# Altium schematic sheet main.SchDoc
size A3
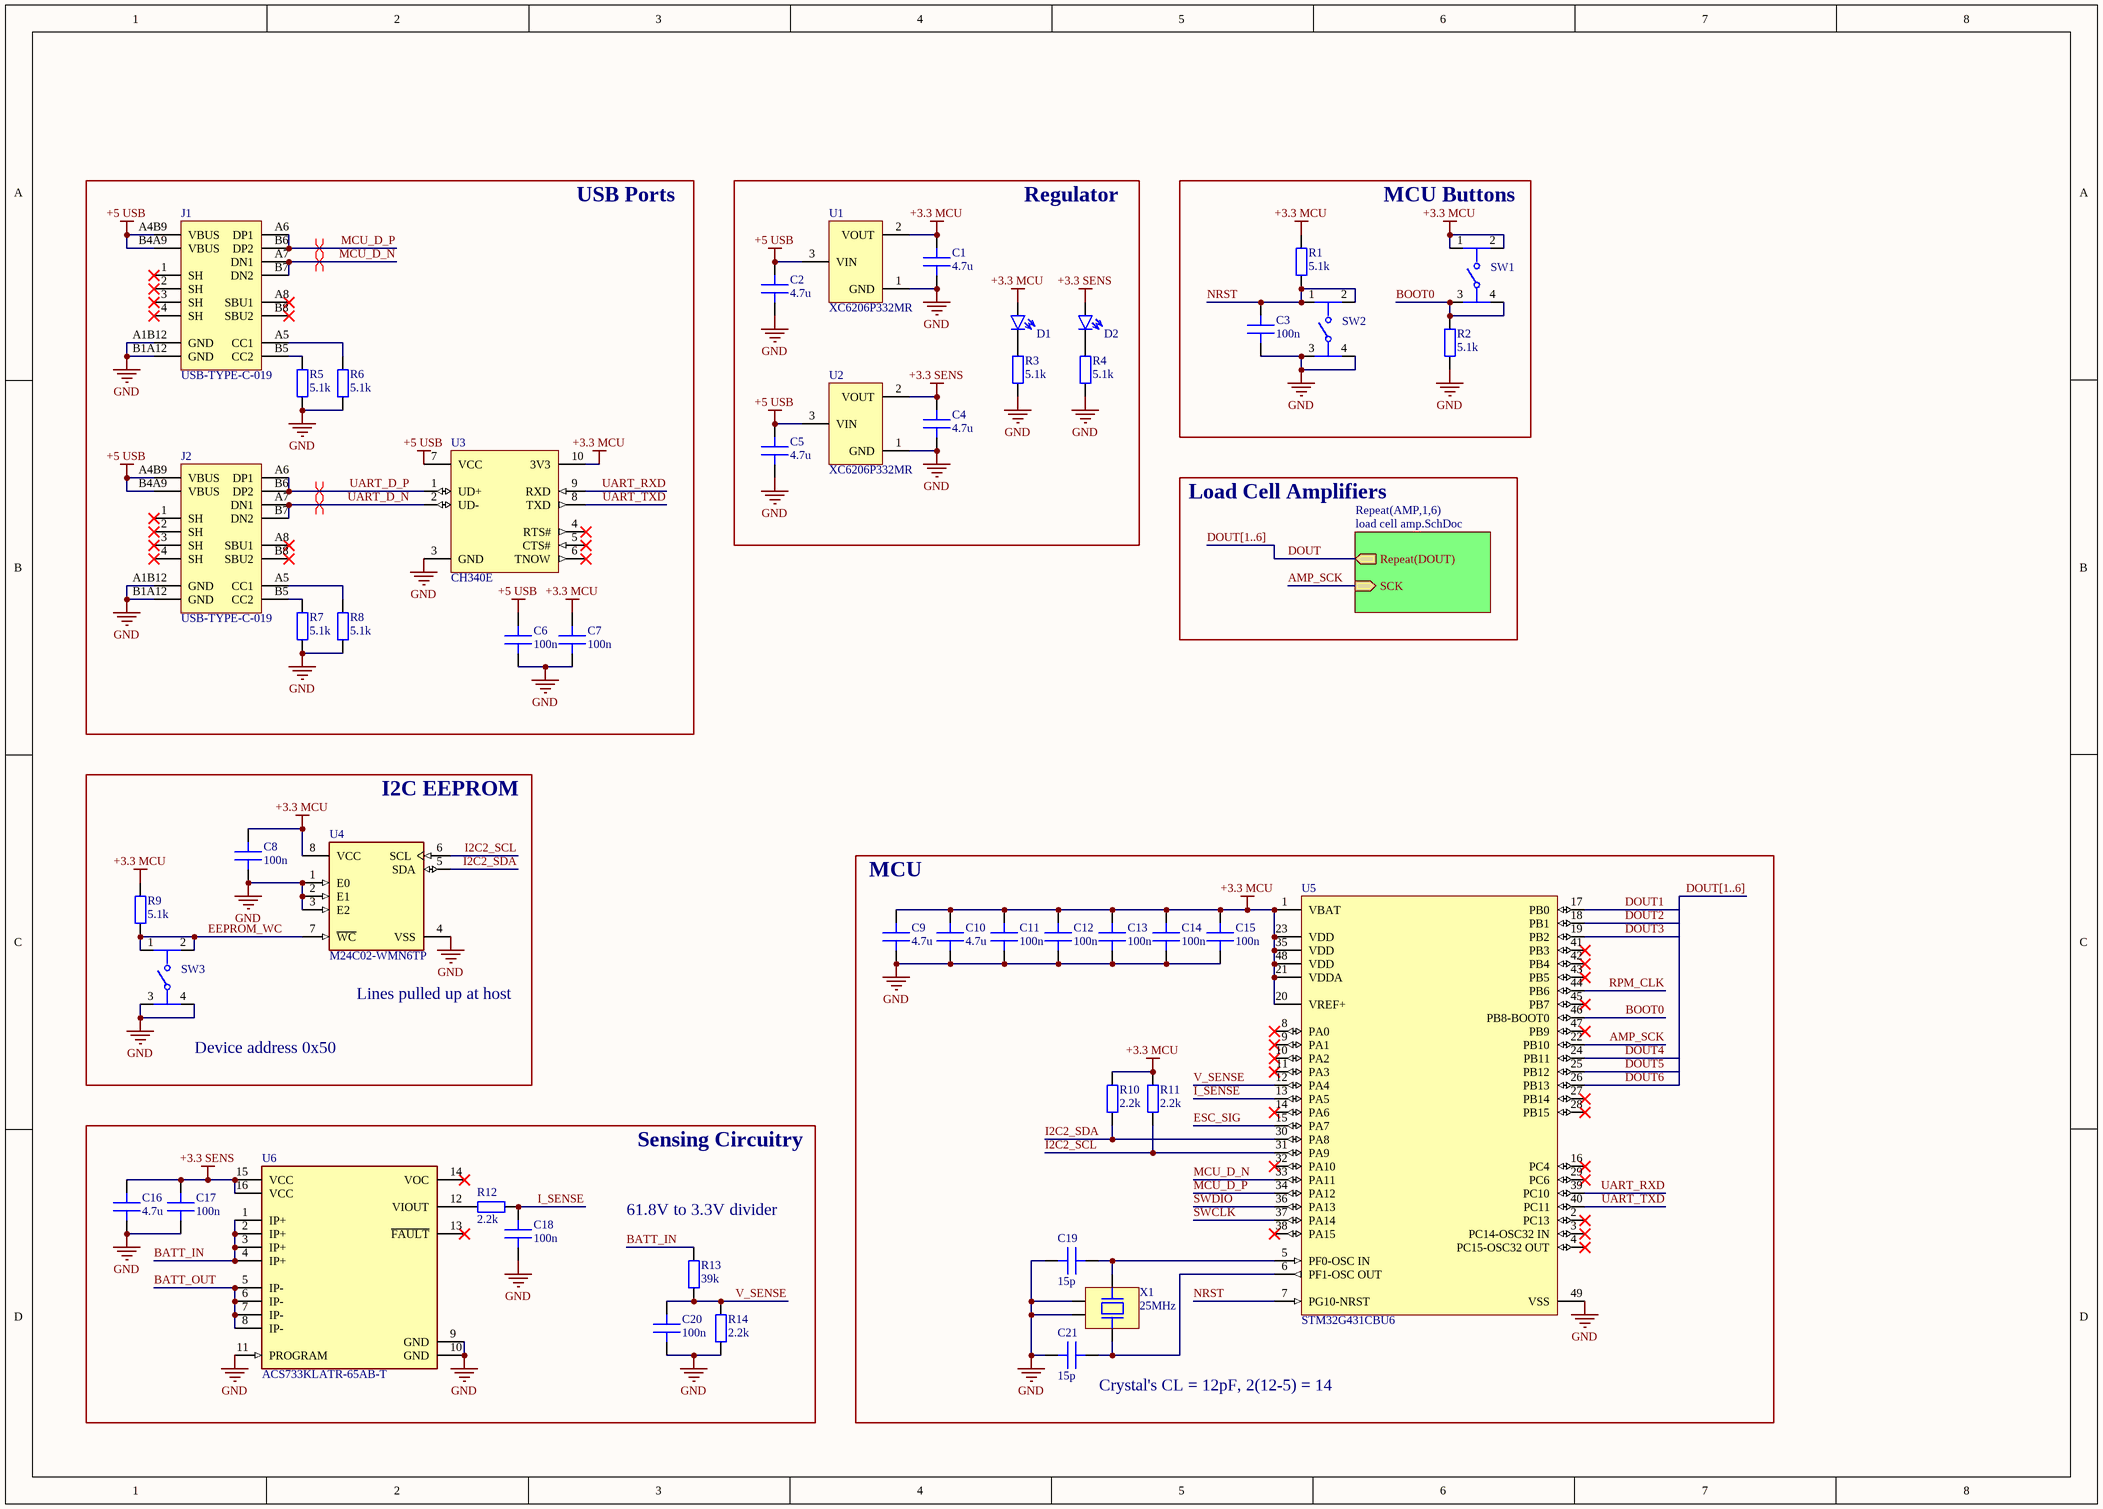
[diagram p0: main.SchDoc]

## Parts
C1  4.7u  [IPC C C0603 NO SILK]
C2  4.7u  [IPC C C0603 NO SILK]
C3  100n  [IPC C C0402 NO SILK]
C4  4.7u  [IPC C C0603 NO SILK]
C5  4.7u  [IPC C C0603 NO SILK]
C6  100n  [IPC C C0402 NO SILK]
C7  100n  [IPC C C0402 NO SILK]
C8  100n  [IPC C C0402 NO SILK]
C9  4.7u  [IPC C C0603 NO SILK]
C10  4.7u  [IPC C C0603 NO SILK]
C11  100n  [IPC C C0402 NO SILK]
C12  100n  [IPC C C0402 NO SILK]
C13  100n  [IPC C C0402 NO SILK]
C14  100n  [IPC C C0402 NO SILK]
C15  100n  [IPC C C0402 NO SILK]
C16  4.7u  [IPC C C0603 NO SILK]
C17  100n  [IPC C C0402 NO SILK]
C18  100n  [IPC C C0402 NO SILK]
C19  15p  [IPC C C0402 NO SILK]
C20  100n  [IPC C C0402 NO SILK]
C21  15p  [IPC C C0402 NO SILK]
D1  Generic LED 0603  [IPC C D0603]  (value not drawn)
D2  Generic LED 0603  [IPC C D0603]  (value not drawn)
J1  USB-TYPE-C-019  [USB-TYPE-C-12+4P]
J2  USB-TYPE-C-019  [USB-TYPE-C-12+4P]
R1  5.1k  [IPC C R0402 NO SILK]
R2  5.1k  [IPC C R0402 NO SILK]
R3  5.1k  [IPC C R0402 NO SILK]
R4  5.1k  [IPC C R0402 NO SILK]
R5  5.1k  [IPC C R0402 NO SILK]
R6  5.1k  [IPC C R0402 NO SILK]
R7  5.1k  [IPC C R0402 NO SILK]
R8  5.1k  [IPC C R0402 NO SILK]
R9  5.1k  [IPC C R0402 NO SILK]
R10  2.2k  [IPC C R0402 NO SILK]
R11  2.2k  [IPC C R0402 NO SILK]
R12  2.2k  [IPC C R0402 NO SILK]
R13  39k  [IPC C R0402 NO SILK]
R14  2.2k  [IPC C R0402 NO SILK]
SW1  PTS810SJM250SMTRLFS  [FP-PTS810SJM250SMTRLFS-MFG]  (value not drawn)
SW2  PTS810SJM250SMTRLFS  [FP-PTS810SJM250SMTRLFS-MFG]  (value not drawn)
SW3  PTS810SJM250SMTRLFS  [FP-PTS810SJM250SMTRLFS-MFG]  (value not drawn)
U1  XC6206P332MR  [SOT23-3]
U2  XC6206P332MR  [SOT23-3]
U3  CH340E  [MSOP-UN10_L]
U4  M24C02-WMN6TP  [FP-SO8N-SO-A-MFG]
U5  STM32G431CBU6  [QFN50P700X700X60_HS-49L]
U6  ACS733KLATR-65AB-T  [FP-LA-16-MFG]
X1  25MHz  [OSC-SMD_4P-L3.2-W2.5-BL]

## Blocks framed on the sheet
USB Ports: C6 C7 J1 J2 R5-R8 U3
Regulator: C1 C2 C4 C5 D1 D2 R3 R4 U1 U2
MCU Buttons: C3 R1 R2 SW1 SW2
I2C EEPROM: C8 R9 SW3 U4
MCU: C9-C15 C19 C21 R10 R11 U5 X1
Sensing Circuitry: C16-C18 C20 R12-R14 U6

## Sub-sheets
Repeat(AMP,1,6) = load cell amp.SchDoc: Repeat(DOUT) (out), SCK (in)

## Nets
+3.3 MCU: C1.2 C7.2 C8.2 C9.2 C10.2 C11.2 C12.2 C13.2 C14.2 C15.2 D1.1(A) R1.2 R9.2 R10.2 R11.2 SW1.1 SW1.2 U1.2(VOUT) U3.10(3V3) U4.8(VCC) U5.1(VBAT) U5.20(VREF+) U5.21(VDDA) U5.23(VDD) U5.35(VDD) U5.48(VDD)
+3.3 SENS: C4.2 C16.2 C17.2 D2.1(A) U2.2(VOUT) U6.15(VCC) U6.16(VCC)
+5 USB: C2.2 C5.2 C6.2 J1.A4B9(VBUS) J1.B4A9(VBUS) J2.A4B9(VBUS) J2.B4A9(VBUS) U1.3(VIN) U2.3(VIN) U3.7(VCC)
GND: C1.1 C2.1 C3.1 C4.1 C5.1 C6.1 C7.1 C8.1 C9.1 C10.1 C11.1 C12.1 C13.1 C14.1 C15.1 C16.1 C17.1 C18.1 C19.2 C20.1 C21.2 J1.A1B12(GND) J1.B1A12(GND) J2.A1B12(GND) J2.B1A12(GND) R2.1 R3.1 R4.1 R5.1 R6.1 R7.1 R8.1 R14.1 SW2.3 SW2.4 SW3.3 SW3.4 U1.1(GND) U2.1(GND) U3.3(GND) U4.1(E0) U4.2(E1) U4.3(E2) U4.4(VSS) U5.49(VSS) U6.9(GND) U6.10(GND) U6.11(PROGRAM) X1.2 X1.4
AMP_SCK: U5.22(PB10) ; sheet Repeat(AMP,1,6)/SCK
BATT_IN: R13.2 U6.1(IP+) U6.2(IP+) U6.3(IP+) U6.4(IP+)
BATT_OUT: U6.5(IP-) U6.6(IP-) U6.7(IP-) U6.8(IP-)
BOOT0: R2.2 SW1.3 SW1.4 U5.46(PB8-BOOT0)
DOUT: sheet Repeat(AMP,1,6)/Repeat(DOUT)
DOUT1: U5.17(PB0)
DOUT2: U5.18(PB1)
DOUT3: U5.19(PB2)
DOUT4: U5.24(PB11)
DOUT5: U5.25(PB12)
DOUT6: U5.26(PB13)
EEPROM_WC: R9.1 SW3.1 SW3.2 U4.7(~{WC})
ESC_SIG: U5.15(PA7)
I2C2_SCL: R11.1 U4.6(SCL) U5.31(PA9)
I2C2_SDA: R10.1 U4.5(SDA) U5.30(PA8)
I_SENSE: C18.2 R12.1 U5.13(PA5)
MCU_D_N: J1.A7(DN1) J1.B7(DN2) U5.33(PA11)
MCU_D_P: J1.A6(DP1) J1.B6(DP2) U5.34(PA12)
NRST: C3.2 R1.1 SW2.1 SW2.2 U5.7(PG10-NRST)
RPM_CLK: U5.44(PB6)
SWCLK: U5.37(PA14)
SWDIO: U5.36(PA13)
UART_D_N: J2.A7(DN1) J2.B7(DN2) U3.2(UD-)
UART_D_P: J2.A6(DP1) J2.B6(DP2) U3.1(UD+)
UART_RXD: U3.9(RXD) U5.39(PC10)
UART_TXD: U3.8(TXD) U5.40(PC11)
V_SENSE: C20.2 R13.1 R14.2 U5.12(PA4)
NetC19_1: C19.1 U5.5(PF0-OSC_IN) X1.1
NetC21_1: C21.1 U5.6(PF1-OSC_OUT) X1.3
NetD1_2: D1.2(C) R3.2
NetD2_2: D2.2(C) R4.2
NetJ1_A5: J1.A5(CC1) R6.2
NetJ1_B5: J1.B5(CC2) R5.2
NetJ2_A5: J2.A5(CC1) R8.2
NetJ2_B5: J2.B5(CC2) R7.2
NetR12_2: R12.2 U6.12(VIOUT)

Not connected (* = marked no-connect by the designer): J1 1(SH)* 2(SH)* 3(SH)* 4(SH)* A8(SBU1)* B8(SBU2)*; J2 1(SH)* 2(SH)* 3(SH)* 4(SH)* A8(SBU1)* B8(SBU2)*; U3 4(RTS#)* 5(CTS#)* 6(TNOW)*; U5 2(PC13)* 3(PC14-OSC32_IN)* 4(PC15-OSC32_OUT)* 8(PA0)* 9(PA1)* 10(PA2)* 11(PA3)* 14(PA6)* 16(PC4)* 27(PB14)* 28(PB15)* 29(PC6)* 32(PA10)* 38(PA15)* 41(PB3)* 42(PB4)* 43(PB5)* 45(PB7)* 47(PB9)*; U6 13(~{FAULT})* 14(VOC)*

## Buses and harness runs
bus DOUT[1..6]

## Layout directives
differential pair: MCU_D_N, MCU_D_P, UART_D_N, UART_D_P

## Notes on the sheet
- Load Cell Amplifiers
- (near SW3) Device address 0x50
- (near U4) Lines pulled up at host
- (near R13) 61.8V to 3.3V divider
- (near C21) Crystal's CL = 12pF, 2(12-5) = 14

## Library data of the parts
C1 C2 C4 C5 C9 C10 C16 = Generic CAP 0603: Value: 4.7u
C3 C6-C8 C11-C15 C17-C21 = Generic CAP 0402
  C3 C6-C8 C11-C15 C17 C18 C20: Value: 100n
  C19 C21: Value: 15p
J1 J2 = USB-TYPE-C-019: Connector Type:Type-C Standard:- Gender:Female Number of Contacts:16 Number of Ports:1 Mounting Style:Surface Mount Current Rating - Power (Max):3A Operating Temperature Range:-25℃~+85℃ Operating Temperature Range:-25℃~+85℃; Manufacturer: DEALON(德艺隆); Add into BOM: yes; Connector Type: Type-C; Gender: Female; Number of Contacts: 16; Number of Ports: 1; Current Rating - Power (Max): 3A; Symbol: USB-TYPE-C-019; Device: USB-TYPE-C-019; LCSC Part Name: Type-C 母座 卧贴; Supplier Part: C2927039; Manufacturer Part: USB-TYPE-C-019; Supplier Footprint: SMD; JLCPCB Part Class: Extended Part; Datasheet: https://atta.szlcsc.com/upload/public/pdf/source/20211217/CCD3D517E355E8E0CC52ABD8D5784AD8.pdf; Supplier: LCSC; Convert to PCB: yes; Standard: -; Mounting Style: Surface Mount; Operating Temperature Range: -25℃~+85℃
R1-R14 = Generic RES 0402
  R1-R9: Value: 5.1k
  R10-R12 R14: Value: 2.2k
  R13: Value: 39k
SW1-SW3 = CMP-10040-000001-2: SWITCH TACTILE SPST-NO 0.05A 16V; Throw Configuration: SPST; Operating Force: 160gf; Actuator Type: Standard; Switch Travel: 0.15mm; Switch Function: Off-Mom; Max Current Rating: 50mA; Mechanical Life: 150000Cycles; Illumination Type: Non-Illuminated; Package Quantity: 2900; Depth: 4.6mm; Mount: Surface Mount; Packaging: Tape and Reel; Length: 3.2mm; RoHS Compliant: Yes; Case/Package: SMD/SMT; Voltage Rating (DC): 16V; Min Operating Temperature: -40°C; Termination: J-Bend; Lead Free: Lead Free; Contact Plating: Silver; Orientation: Straight; Max Operating Temperature: 85°C; Current Rating: 50mA; Color: Black
U1 U2 = 3.3V Regulator XC6206P332MR_C5446: Output Type: Output Polarity:Positive Number of Outputs:1 Maximum Input Voltage:6V Output Voltage:3.3V~3.3V Output Voltage:3.3V~3.3V Dropout Voltage:680mV@(100mA) Output Current:200mA Power Supply Rejection Ratio (PSRR):-; Manufacturer: TOREX(特瑞仕); Add into BOM: yes; Number of Outputs: 1; Maximum Input Voltage: 6V; Output Current: 200mA; Symbol: XC6206P332MR; Device: XC6206P332MR_C5446; LCSC Part Name: 正 Vin=6V Vout=3.3V 200mA; Supplier Part: C5446; Manufacturer Part: XC6206P332MR; Supplier Footprint: SOT-23-3L; JLCPCB Part Class: Basic Part; Datasheet: https://atta.szlcsc.com/upload/public/pdf/source/20130801/1457706628791.pdf; Supplier: LCSC; Convert to PCB: yes; Output Polarity: Positive; Output Voltage: 3.3V~3.3V; Dropout Voltage: 680mV@(100mA); Power Supply Rejection Ratio (PSRR): -
U4 = CMP-2000-05370-2: IC EEPROM 2K I2C 400KHZ 8SO; Manufacturer: STMicroelectronics; Min Supply Voltage: 2.5V; Standoff Height: 0.1mm; Nominal Supply Current: 0.5-1mA; Access Time: 900ns; Memory Size: 2Kbits; Max Supply Voltage: 5.5V; Digikey Description: IC EEPROM 2K I2C 400KHZ 8SO; Memory Type: EEPROM; ComponentLink2URL: https://www.st.com/resource/en/datasheet/m24c02-w.pdf; Device Class L3: EEPROM; Interface: I2C; Temperature Range High: +85°C; Mouser Description: M24C02 Series 2 Kb (256 x 8) 2.5 V SMT Serial I²C Bus EEPROM - SOIC-8; RoHS: TRUE; Lead Free: Yes; Ambient Temperature Range Low: -40°C; Temperature: -40°C to +85°C; Device Class L1: Integrated Circuits (ICs); Temperature Range Low: -40°C; Frequency: 400kHz; Category: IC; Manufacturer Part Number: M24C02-WMN6TP; Height: 1.75mm; Octopart: https://octopart.com/m24c02-wmn6tp-stmicroelectronics-55404516; Automotive: No; Ambient Temperature Range High: +85°C; ComponentLink2Description: Datasheet; Package: SO8N-SO-A; Device Class L2: Memory
U6 = CMP-82923-000073-1: AUTOMOTIVE GRADE HIGH BANDWIDTH; Accuracy: 1.7%; Response Time: 200ns; Number of Channels: 1; Frequency: 1MHz; Current Sensing: 65A; Linearity: 0.5%; Max Supply Current: 35mA; Sensitivity: 20mV/A; Polarity: Bidirectional; Min Operating Temperature: -40°C; Max Operating Temperature: 125°C; Packaging: Tape and Reel; Case/Package: SOIC; Mount: Surface Mount; Number of Pins: 16; RoHS Compliant: Yes
X1 = Crystal 25MHz X322525MOB4SI: Crystal Type:SMD Crystal Resonator Frequency: Frequency Tolerance:±10ppm Frequency Tolerance:±10ppm Frequency Stability:±30ppm Frequency Stability:±30ppm Load Capacitance: Operating Temperature: Operating Temperature:; Manufacturer: YXC(扬兴晶振); Add into BOM: yes; Frequency Tolerance: ±10ppm; Frequency Stability: ±30ppm; Symbol: X322525MOB4SI; Device: X322525MOB4SI; LCSC Part Name: 25MHz ±10ppm 12pF; Supplier Part: C9006; Manufacturer Part: X322525MOB4SI; Supplier Footprint: SMD3225-4P; JLCPCB Part Class: Basic Part; Datasheet: https://atta.szlcsc.com/upload/public/pdf/source/20210329/C112971_1F611BDC486E193C1706F6D8EB5AA189.pdf; Supplier: LCSC; Convert to PCB: yes; Crystal Type: SMD Crystal Resonator; Value: 25MHz